# Altium project MSXII_Controller_Breakout.PrjPcb
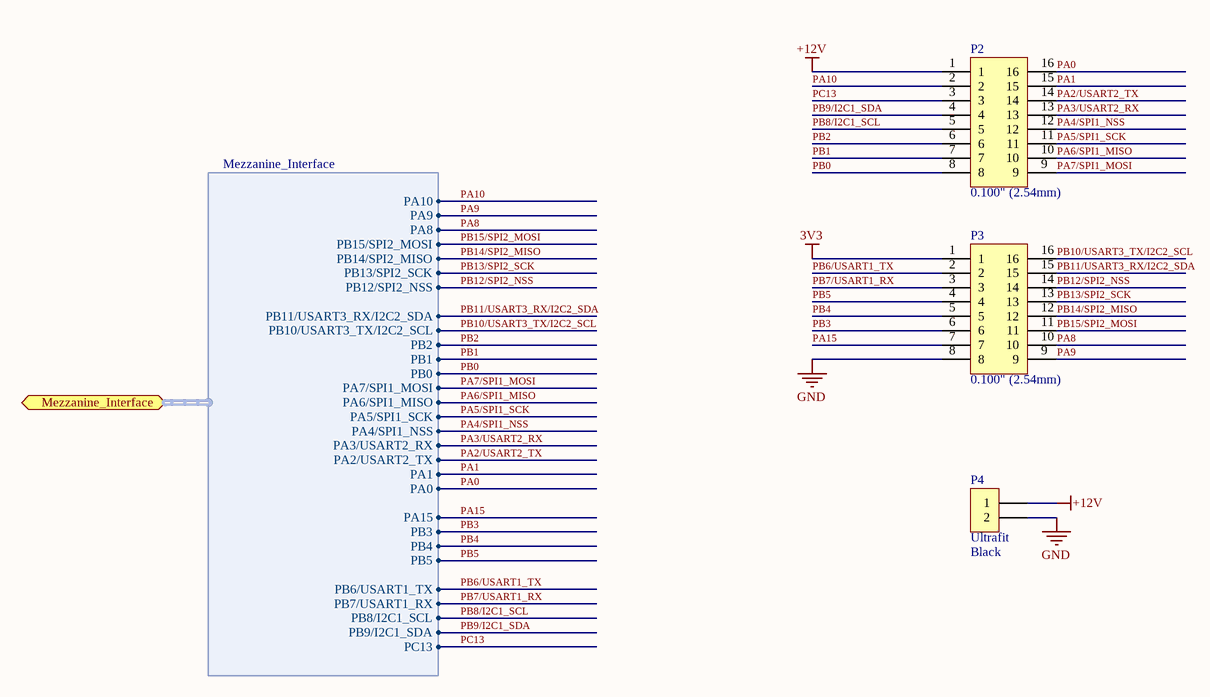
[diagram p0: MSXII_Controller_Breakout.SchDoc]
2 sheets, 4 parts. Net scope: flat (ports and power ports of the same name join across sheets).
Board file: MSXII_Controller_Breakout.PcbDoc
Sheets:
  MSXII_Controller_Breakout.SchDoc
  Controller_Board_Interface.SchDoc

## Sheet MSXII_Controller_Breakout.SchDoc: Controller Board Breakout
size Letter; Author: Kevin Chen, Taiping Li, Titus Chow; Revision: 3.0; SheetNumber: 1; SheetTotal: 2; Website: www.uwmidsun.com

### Parts
P2  Pitch - Mating: 0.100" (2.54mm)  [CONN, 16POS 0.100" Header]  (hidden comment: 16POS)
P3  Pitch - Mating: 0.100" (2.54mm)  [CONN, 16POS 0.100" Header]  (hidden comment: 16POS)
P4  Insulation Color: Black  Series: Ultrafit  [CONN, 2POS ULTRA-FIT]  (hidden comment: CONN 2POS ULTRA-FIT 0.138")

### Ports
Mezzanine_Interface (harness Mezzanine_Interface)

### Harnesses
Mezzanine_Interface: PA10, PA9, PA8, PB15/SPI2_MOSI, PB14/SPI2_MISO, PB13/SPI2_SCK, PB12/SPI2_NSS, PB11/USART3_RX/I2C2_SDA, PB10/USART3_TX/I2C2_SCL, PB2, PB1, PB0, PA7/SPI1_MOSI, PA6/SPI1_MISO, PA5/SPI1_SCK, PA4/SPI1_NSS, PA3/USART2_RX, PA2/USART2_TX, PA1, PA0, PA15, PB3, PB4, PB5, PB6/USART1_TX, PB7/USART1_RX, PB8/I2C1_SCL, PB9/I2C1_SDA, PC13

### Nets
3V3: P3.1
+12V: P2.1 P4.1
GND: P3.8 P4.2
PA0: P2.16 ; port Mezzanine_Interface.PA0
PA1: P2.15 ; port Mezzanine_Interface.PA1
PA2/USART2_TX: P2.14 ; port Mezzanine_Interface.PA2/USART2_TX
PA3/USART2_RX: P2.13 ; port Mezzanine_Interface.PA3/USART2_RX
PA4/SPI1_NSS: P2.12 ; port Mezzanine_Interface.PA4/SPI1_NSS
PA5/SPI1_SCK: P2.11 ; port Mezzanine_Interface.PA5/SPI1_SCK
PA6/SPI1_MISO: P2.10 ; port Mezzanine_Interface.PA6/SPI1_MISO
PA7/SPI1_MOSI: P2.9 ; port Mezzanine_Interface.PA7/SPI1_MOSI
PA8: P3.10 ; port Mezzanine_Interface.PA8
PA9: P3.9 ; port Mezzanine_Interface.PA9
PA10: P2.2 ; port Mezzanine_Interface.PA10
PA15: P3.7 ; port Mezzanine_Interface.PA15
PB0: P2.8 ; port Mezzanine_Interface.PB0
PB1: P2.7 ; port Mezzanine_Interface.PB1
PB2: P2.6 ; port Mezzanine_Interface.PB2
PB3: P3.6 ; port Mezzanine_Interface.PB3
PB4: P3.5 ; port Mezzanine_Interface.PB4
PB5: P3.4 ; port Mezzanine_Interface.PB5
PB6/USART1_TX: P3.2 ; port Mezzanine_Interface.PB6/USART1_TX
PB7/USART1_RX: P3.3 ; port Mezzanine_Interface.PB7/USART1_RX
PB8/I2C1_SCL: P2.5 ; port Mezzanine_Interface.PB8/I2C1_SCL
PB9/I2C1_SDA: P2.4 ; port Mezzanine_Interface.PB9/I2C1_SDA
PB10/USART3_TX/I2C2_SCL: P3.16 ; port Mezzanine_Interface.PB10/USART3_TX/I2C2_SCL
PB11/USART3_RX/I2C2_SDA: P3.15 ; port Mezzanine_Interface.PB11/USART3_RX/I2C2_SDA
PB12/SPI2_NSS: P3.14 ; port Mezzanine_Interface.PB12/SPI2_NSS
PB13/SPI2_SCK: P3.13 ; port Mezzanine_Interface.PB13/SPI2_SCK
PB14/SPI2_MISO: P3.12 ; port Mezzanine_Interface.PB14/SPI2_MISO
PB15/SPI2_MOSI: P3.11 ; port Mezzanine_Interface.PB15/SPI2_MOSI
PC13: P2.3 ; port Mezzanine_Interface.PC13

### Notes on the sheet
- Project:
- Title:
- Size:
- Project Lead:
- Letter
- Revision:
- University of Waterloo
- 200 University Ave W
- Waterloo, ON, Canada
- N2L 3E9
- Date:
- Sheet
- of
- Website:

### Library data of the parts
P2 P3 = CONN 16POS HEADR MALE 0.1": CONN HEADER .100" DUAL STR 16POS; Manufacturer 1: Sullins Connector Solutions; Manufacturer Part Number 1: PREC008DAAN-RC; Connector Type: Header, Breakaway; Style: Board to Board or Cable; Shrouding: Unshrouded; Number of Positions: 16; Number of Positions Loaded: All; Contact Length - Mating: 0.230" (5.84mm); Contact Length - Post: 0.120" (3.05mm); Overall Contact Length: 0.448" (11.39mm); Material Flammability Rating: UL94 V-0; Current Rating: 3A per Contact; Supplier 1: Digi-Key; Supplier Part Number 1: S2012EC-08-ND; Packaging: Bulk; Part Status: Active; Contact Type: Male Pin; Number of Rows: 2; Row Spacing - Mating: 0.100" (2.54mm); Mounting Type: Through Hole; Termination: Solder; Fastening Type: -; Insulation Height: 0.098" (2.50mm); Contact Shape: Square; Contact Finish - Mating: Tin; Contact Finish Thickness - Mating: -; Contact Finish - Post: Tin; Contact Material: Brass; Insulation Material: Polybutylene Terephthalate (PBT); Operating Temperature: -40°C ~ 105°C; Ingress Protection: -; Insulation Color: Black; Mated Stacking Heights: -; Contact Finish Thickness - Post: -; ComponentLink1URL: http://sullinscorp.com/drawings/294___R__C_____D___N-RC,_11636.pdf; ComponentLink1Description: http://sullinscorp.com/drawings/294___R__C_____D___N-RC,_11636.pdf; Voltage: -
P4 = CONN 2POS ULTRA-FIT 0.138": 2 Positions Header, Shrouded Connector 0.138" (3.50mm) Through Hole Gold; Manufacturer: Molex, LLC; Manufacturer Part Number: 1722871102; Style: Board to Cable/Wire; Shrouding: Shrouded - 4 Wall; Number of Positions: 2; Number of Positions Loaded: All; Contact Length - Post: 0.126" (3.20mm); Material Flammability Rating: UL94 V-0; Voltage Rating: 400V; Mated Stacking Heights: 26.99mm; Supplier 1: Digi-Key; RoHS: RoHS Compliant; Category: Connectors, Interconnects; Stock 1: 2637; Pricing 1: 1=1.09, 10=0.953, 25=0.8968, 50=0.8592, 100=0.8218, 250=0.74712, 500=0.67242, 1000=0.5977, 2500=0.54166 (CAD); Packaging: Tray; Part Status: Active; Connector Type: Header; Contact Type: Male Pin; Pitch - Mating: 0.138" (3.50mm); Number of Rows: 1; Row Spacing - Mating: -; Mounting Type: Through Hole; Termination: Solder; Fastening Type: Latch Holder; Contact Length - Mating: -; Overall Contact Length: -; Insulation Height: 0.465" (11.80mm); Contact Shape: Square; Contact Finish - Mating: Tin; Contact Finish Thickness - Mating: 60µin (1.52µm); Contact Finish - Post: Tin; Contact Material: Copper Alloy; Insulation Material: Liquid Crystal Polymer (LCP); Features: Board Guide, Solder Retention; Operating Temperature: -40°C ~ 105°C; Ingress Protection: -; Current Rating: -; Contact Finish Thickness - Post: 60µin (1.52µm); Applications: Automotive, General Purpose, Industrial, Lighting, Medical, Military, Telecommunications; ComponentLink1URL: http://www.molex.com/pdm_docs/sd/1722871102_sd.pdf; ComponentLink1Description: http://www.molex.com/pdm_docs/sd/1722871102_sd.pdf; Supplier Part Number 1: WM11701-ND

## Sheet Controller_Board_Interface.SchDoc: Controller Board Interface
size Letter; Author: Kevin Chen, Taiping Li, Titus Chow; Revision: 3.0; SheetNumber: 2; SheetTotal: 2; Website: www.uwmidsun.com
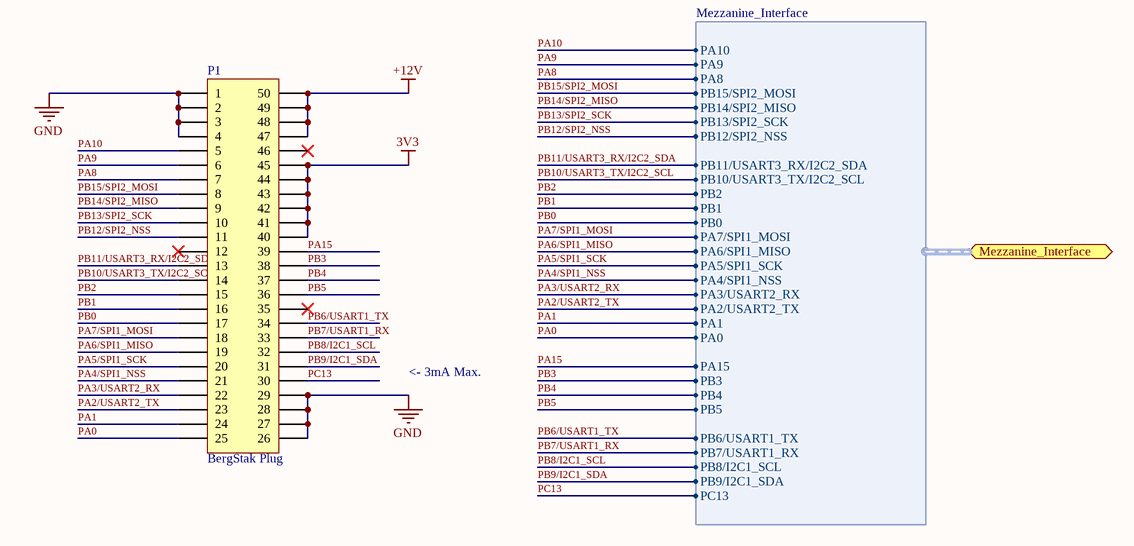
[diagram p1: Controller_Board_Interface.SchDoc]

### Parts
P1  Series: BergStak Plug  [CONN, Bergstak 50 Pos Plug]  (hidden comment: CONN 50POS Bergstak Plug 0.02")

### Ports
Mezzanine_Interface (harness Mezzanine_Interface)

### Harnesses
Mezzanine_Interface: PA10, PA9, PA8, PB15/SPI2_MOSI, PB14/SPI2_MISO, PB13/SPI2_SCK, PB12/SPI2_NSS, PB11/USART3_RX/I2C2_SDA, PB10/USART3_TX/I2C2_SCL, PB2, PB1, PB0, PA7/SPI1_MOSI, PA6/SPI1_MISO, PA5/SPI1_SCK, PA4/SPI1_NSS, PA3/USART2_RX, PA2/USART2_TX, PA1, PA0, PA15, PB3, PB4, PB5, PB6/USART1_TX, PB7/USART1_RX, PB8/I2C1_SCL, PB9/I2C1_SDA, PC13

### Nets
3V3: P1.40 P1.41 P1.42 P1.43 P1.44 P1.45
+12V: P1.47 P1.48 P1.49 P1.50
GND: P1.1 P1.2 P1.3 P1.4 P1.26 P1.27 P1.28 P1.29
PA0: P1.25 ; port Mezzanine_Interface.PA0
PA1: P1.24 ; port Mezzanine_Interface.PA1
PA2/USART2_TX: P1.23 ; port Mezzanine_Interface.PA2/USART2_TX
PA3/USART2_RX: P1.22 ; port Mezzanine_Interface.PA3/USART2_RX
PA4/SPI1_NSS: P1.21 ; port Mezzanine_Interface.PA4/SPI1_NSS
PA5/SPI1_SCK: P1.20 ; port Mezzanine_Interface.PA5/SPI1_SCK
PA6/SPI1_MISO: P1.19 ; port Mezzanine_Interface.PA6/SPI1_MISO
PA7/SPI1_MOSI: P1.18 ; port Mezzanine_Interface.PA7/SPI1_MOSI
PA8: P1.7 ; port Mezzanine_Interface.PA8
PA9: P1.6 ; port Mezzanine_Interface.PA9
PA10: P1.5 ; port Mezzanine_Interface.PA10
PA15: P1.39 ; port Mezzanine_Interface.PA15
PB0: P1.17 ; port Mezzanine_Interface.PB0
PB1: P1.16 ; port Mezzanine_Interface.PB1
PB2: P1.15 ; port Mezzanine_Interface.PB2
PB3: P1.38 ; port Mezzanine_Interface.PB3
PB4: P1.37 ; port Mezzanine_Interface.PB4
PB5: P1.36 ; port Mezzanine_Interface.PB5
PB6/USART1_TX: P1.34 ; port Mezzanine_Interface.PB6/USART1_TX
PB7/USART1_RX: P1.33 ; port Mezzanine_Interface.PB7/USART1_RX
PB8/I2C1_SCL: P1.32 ; port Mezzanine_Interface.PB8/I2C1_SCL
PB9/I2C1_SDA: P1.31 ; port Mezzanine_Interface.PB9/I2C1_SDA
PB10/USART3_TX/I2C2_SCL: P1.14 ; port Mezzanine_Interface.PB10/USART3_TX/I2C2_SCL
PB11/USART3_RX/I2C2_SDA: P1.13 ; port Mezzanine_Interface.PB11/USART3_RX/I2C2_SDA
PB12/SPI2_NSS: P1.11 ; port Mezzanine_Interface.PB12/SPI2_NSS
PB13/SPI2_SCK: P1.10 ; port Mezzanine_Interface.PB13/SPI2_SCK
PB14/SPI2_MISO: P1.9 ; port Mezzanine_Interface.PB14/SPI2_MISO
PB15/SPI2_MOSI: P1.8 ; port Mezzanine_Interface.PB15/SPI2_MOSI
PC13: P1.30 ; port Mezzanine_Interface.PC13

Not connected (* = marked no-connect by the designer): P1 12* 35* 46*

### Notes on the sheet
- <- 3mA Max.
- Project:
- Title:
- Size:
- Project Lead:
- Letter
- Revision:
- University of Waterloo
- 200 University Ave W
- Waterloo, ON, Canada
- N2L 3E9
- Date:
- Sheet
- of
- Website:

### Library data of the parts
P1 = CONN 50POS Bergstak Plug 0.02": 50 Position Connector Plug, Outer Shroud Contacts Surface Mount Gold; Manufacturer 1: Amphenol FCI; Manufacturer Part Number 1: 10132797-055100LF; Number of Positions: 50; Mated Stacking Heights: 5mm; Pitch: 0.020" (0.50mm); Supplier 1: Digi-Key; Supplier Part Number 1: 609-5226-1-ND; Packaging: Cut Tape (CT); Part Status: Active; Connector Type: Plug, Outer Shroud Contacts; Number of Rows: 2; Mounting Type: Surface Mount; Contact Finish: Gold; Contact Finish Thickness: 1µin (0.025µm); Height Above Board: 0.169" (4.30mm); ComponentLink1URL: http://portal.fciconnect.com/Comergent//fci/drawing/10132797.pdf; ComponentLink1Description: http://portal.fciconnect.com/Comergent//fci/drawing/10132797.pdf

## Nets that join several sheets
3V3: MSXII_Controller_Breakout (P3.1), Controller_Board_Interface (6 pins)
+12V: MSXII_Controller_Breakout (P2.1 P4.1), Controller_Board_Interface (P1.47 P1.48 P1.49 P1.50)
GND: MSXII_Controller_Breakout (P3.8 P4.2), Controller_Board_Interface (8 pins)
PA0: MSXII_Controller_Breakout (P2.16), Controller_Board_Interface (P1.25)
PA1: MSXII_Controller_Breakout (P2.15), Controller_Board_Interface (P1.24)
PA2/USART2_TX: MSXII_Controller_Breakout (P2.14), Controller_Board_Interface (P1.23)
PA3/USART2_RX: MSXII_Controller_Breakout (P2.13), Controller_Board_Interface (P1.22)
PA4/SPI1_NSS: MSXII_Controller_Breakout (P2.12), Controller_Board_Interface (P1.21)
PA5/SPI1_SCK: MSXII_Controller_Breakout (P2.11), Controller_Board_Interface (P1.20)
PA6/SPI1_MISO: MSXII_Controller_Breakout (P2.10), Controller_Board_Interface (P1.19)
PA7/SPI1_MOSI: MSXII_Controller_Breakout (P2.9), Controller_Board_Interface (P1.18)
PA8: MSXII_Controller_Breakout (P3.10), Controller_Board_Interface (P1.7)
PA9: MSXII_Controller_Breakout (P3.9), Controller_Board_Interface (P1.6)
PA10: MSXII_Controller_Breakout (P2.2), Controller_Board_Interface (P1.5)
PA15: MSXII_Controller_Breakout (P3.7), Controller_Board_Interface (P1.39)
PB0: MSXII_Controller_Breakout (P2.8), Controller_Board_Interface (P1.17)
PB1: MSXII_Controller_Breakout (P2.7), Controller_Board_Interface (P1.16)
PB2: MSXII_Controller_Breakout (P2.6), Controller_Board_Interface (P1.15)
PB3: MSXII_Controller_Breakout (P3.6), Controller_Board_Interface (P1.38)
PB4: MSXII_Controller_Breakout (P3.5), Controller_Board_Interface (P1.37)
PB5: MSXII_Controller_Breakout (P3.4), Controller_Board_Interface (P1.36)
PB6/USART1_TX: MSXII_Controller_Breakout (P3.2), Controller_Board_Interface (P1.34)
PB7/USART1_RX: MSXII_Controller_Breakout (P3.3), Controller_Board_Interface (P1.33)
PB8/I2C1_SCL: MSXII_Controller_Breakout (P2.5), Controller_Board_Interface (P1.32)
PB9/I2C1_SDA: MSXII_Controller_Breakout (P2.4), Controller_Board_Interface (P1.31)
PB10/USART3_TX/I2C2_SCL: MSXII_Controller_Breakout (P3.16), Controller_Board_Interface (P1.14)
PB11/USART3_RX/I2C2_SDA: MSXII_Controller_Breakout (P3.15), Controller_Board_Interface (P1.13)
PB12/SPI2_NSS: MSXII_Controller_Breakout (P3.14), Controller_Board_Interface (P1.11)
PB13/SPI2_SCK: MSXII_Controller_Breakout (P3.13), Controller_Board_Interface (P1.10)
PB14/SPI2_MISO: MSXII_Controller_Breakout (P3.12), Controller_Board_Interface (P1.9)
PB15/SPI2_MOSI: MSXII_Controller_Breakout (P3.11), Controller_Board_Interface (P1.8)
PC13: MSXII_Controller_Breakout (P2.3), Controller_Board_Interface (P1.30)